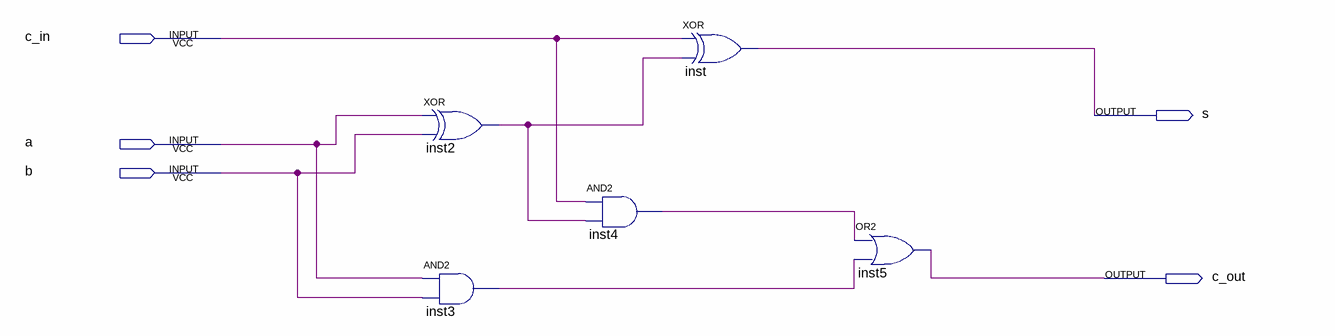
[diagram p0: schematic sheet]
// Quartus schematic adder.bdf as structural Verilog: 5 symbols, 5 pins
module adder (
  input  c_in,
  input  a,
  input  b,
  output s,
  output c_out
);

  wire inst2_out, inst3_out, inst4_out;

  xor inst2 (inst2_out, a, b);
  and inst3 (inst3_out, a, b);
  and inst4 (inst4_out, c_in, inst2_out);
  xor inst (s, c_in, inst2_out);
  or inst5 (c_out, inst4_out, inst3_out);
endmodule
